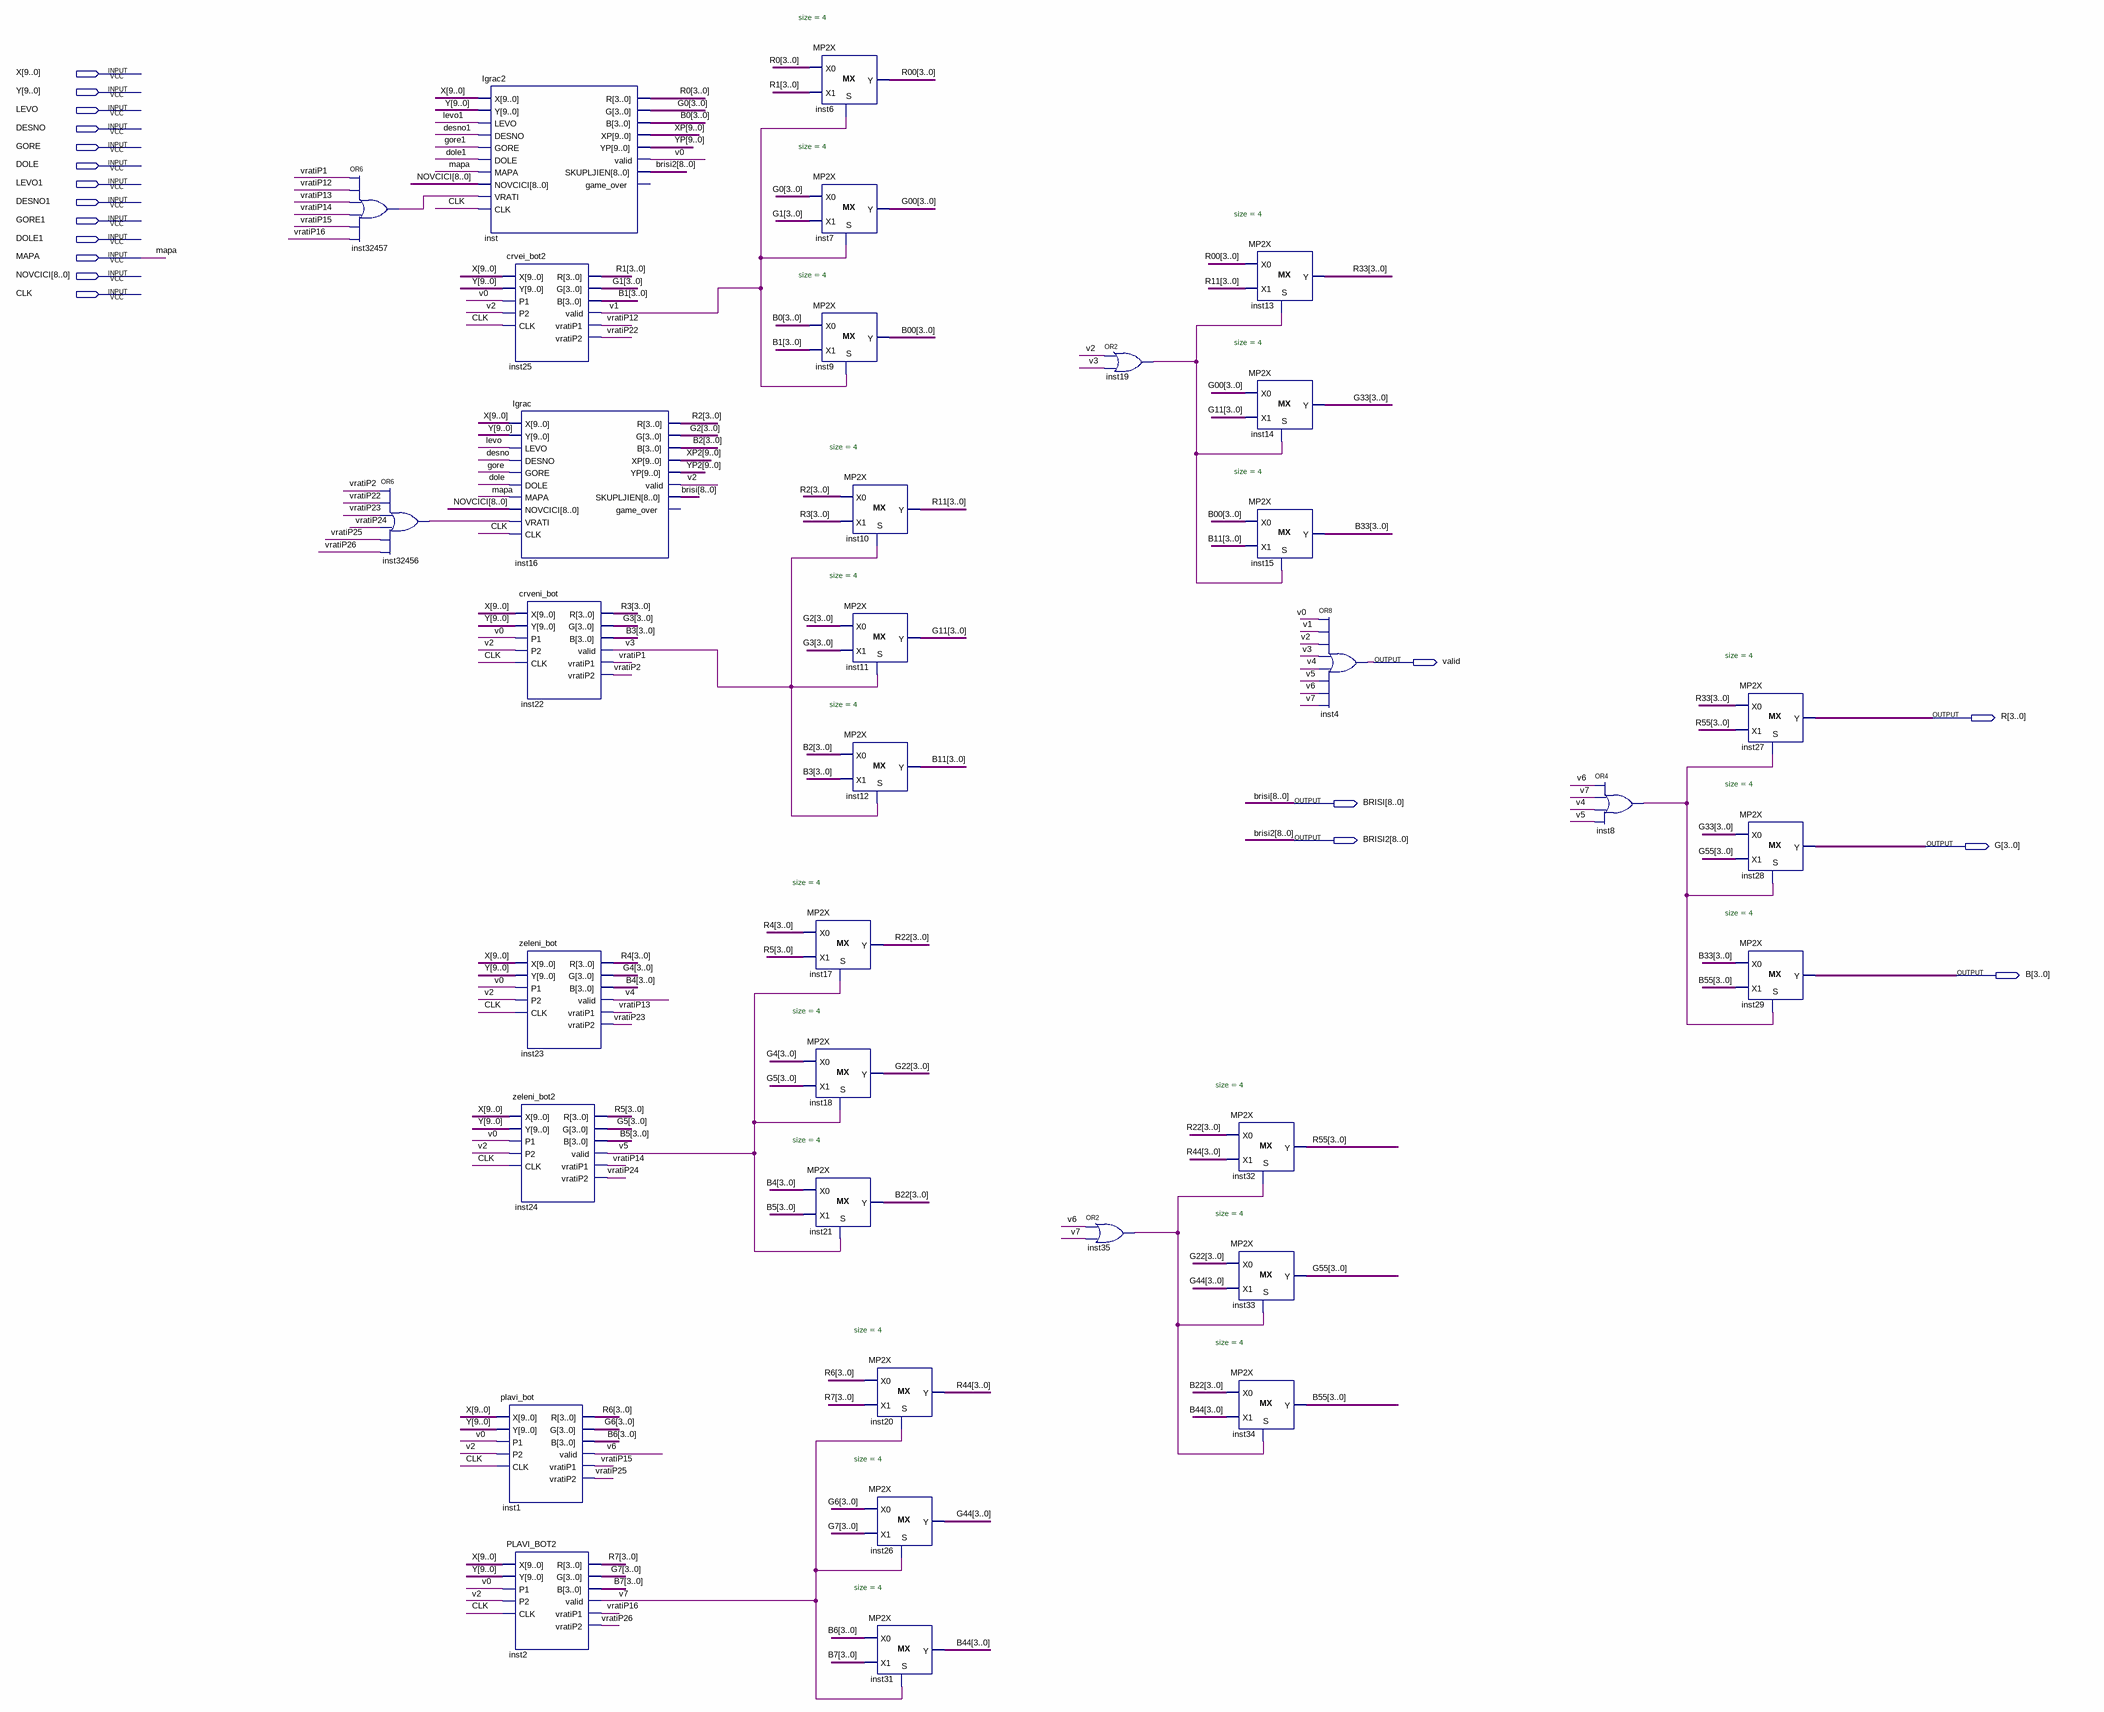
[diagram p0: schematic sheet]
// Quartus schematic igraci.bdf as structural Verilog: 35 symbols, 19 pins
module igraci (
  input  [9:0] X,
  input  [9:0] Y,
  input  LEVO,
  input  DESNO,
  input  GORE,
  input  DOLE,
  input  LEVO1,
  input  DESNO1,
  input  GORE1,
  input  DOLE1,
  input  MAPA,
  input  [8:0] NOVCICI,
  input  CLK,
  output valid,
  output [3:0] R,
  output [8:0] BRISI,
  output [8:0] BRISI2,
  output [3:0] G,
  output [3:0] B
);

  wire inst8_out, inst19_out, inst35_out, inst32456_out, inst32457_out, v0, v1, v2, v3, v4, v5, v6, v7,
       vratiP1, vratiP2, vratiP12, vratiP13, vratiP14, vratiP15, vratiP16, vratiP22, vratiP23, vratiP24,
       vratiP25, vratiP26;
  wire [3:0] B00, B0, B1, B2, B3, B4, B5, B6, B7, B11, B22, B33, B44, B55, G00, G0, G1, G2, G3, G4, G5, G6,
       G7, G11, G22, G33, G44, G55, R0, R00, R1, R2, R3, R4, R5, R6, R7, R11, R22, R33, R44, R55;
  wire [9:0] XP, XP2, YP, YP2;

  or inst32457 (inst32457_out, vratiP1, vratiP12, vratiP13, vratiP14, vratiP15, vratiP16);
  or inst32456 (inst32456_out, vratiP2, vratiP22, vratiP23, vratiP24, vratiP25, vratiP26);
  Igrac2 inst (
    .X(X), .Y(Y), .LEVO(LEVO1), .DESNO(DESNO1), .GORE(GORE1), .DOLE(DOLE1), .MAPA(MAPA), .NOVCICI(NOVCICI),
    .VRATI(inst32457_out), .CLK(CLK), .R(R0), .G(G0), .B(B0), .XP(XP), .YP(YP), .valid(v0), .SKUPLJIEN(BRISI2));  // open: game_over
  crvei_bot2 inst25 (
    .X(X), .Y(Y), .P1(v0), .P2(v2), .CLK(CLK), .R(R1), .G(G1), .B(B1), .valid(v1), .vratiP1(vratiP12),
    .vratiP2(vratiP22));
  Igrac inst16 (
    .X(X), .Y(Y), .LEVO(LEVO), .DESNO(DESNO), .GORE(GORE), .DOLE(DOLE), .MAPA(MAPA), .NOVCICI(NOVCICI),
    .VRATI(inst32456_out), .CLK(CLK), .R(R2), .G(G2), .B(B2), .XP(XP2), .YP(YP2), .valid(v2),
    .SKUPLJIEN(BRISI));  // open: game_over
  zeleni_bot2 inst24 (
    .X(X), .Y(Y), .P1(v0), .P2(v2), .CLK(CLK), .R(R5), .G(G5), .B(B5), .valid(v5), .vratiP1(vratiP14),
    .vratiP2(vratiP24));
  plavi_bot inst1 (
    .X(X), .Y(Y), .P1(v0), .P2(v2), .CLK(CLK), .R(R6), .G(G6), .B(B6), .valid(v6), .vratiP1(vratiP15),
    .vratiP2(vratiP25));
  PLAVI_BOT2 inst2 (
    .X(X), .Y(Y), .P1(v0), .P2(v2), .CLK(CLK), .R(R7), .G(G7), .B(B7), .valid(v7), .vratiP1(vratiP16),
    .vratiP2(vratiP26));
  crveni_bot inst22 (
    .X(X), .Y(Y), .P1(v0), .P2(v2), .CLK(CLK), .R(R3), .G(G3), .B(B3), .valid(v3), .vratiP1(vratiP1),
    .vratiP2(vratiP2));
  zeleni_bot inst23 (
    .X(X), .Y(Y), .P1(v0), .P2(v2), .CLK(CLK), .R(R4), .G(G4), .B(B4), .valid(v4), .vratiP1(vratiP13),
    .vratiP2(vratiP23));
  MP2X #(.size(4)) inst17 (.S(v5), .X0(R4), .X1(R5), .Y(R22));
  MP2X #(.size(4)) inst18 (.S(v5), .X0(G4), .X1(G5), .Y(G22));
  MP2X #(.size(4)) inst21 (.S(v5), .X0(B4), .X1(B5), .Y(B22));
  MP2X #(.size(4)) inst6 (.S(v1), .X0(R0), .X1(R1), .Y(R00));
  MP2X #(.size(4)) inst7 (.S(v1), .X0(G0), .X1(G1), .Y(G00));
  MP2X #(.size(4)) inst9 (.S(v1), .X0(B0), .X1(B1), .Y(B00));
  MP2X #(.size(4)) inst10 (.S(v3), .X0(R2), .X1(R3), .Y(R11));
  MP2X #(.size(4)) inst11 (.S(v3), .X0(G2), .X1(G3), .Y(G11));
  MP2X #(.size(4)) inst12 (.S(v3), .X0(B2), .X1(B3), .Y(B11));
  MP2X #(.size(4)) inst20 (.S(v7), .X0(R6), .X1(R7), .Y(R44));
  MP2X #(.size(4)) inst26 (.S(v7), .X0(G6), .X1(G7), .Y(G44));
  MP2X #(.size(4)) inst31 (.S(v7), .X0(B6), .X1(B7), .Y(B44));
  or inst35 (inst35_out, v6, v7);
  or inst19 (inst19_out, v2, v3);
  MP2X #(.size(4)) inst13 (.S(inst19_out), .X0(R00), .X1(R11), .Y(R33));
  MP2X #(.size(4)) inst14 (.S(inst19_out), .X0(G00), .X1(G11), .Y(G33));
  MP2X #(.size(4)) inst15 (.S(inst19_out), .X0(B00), .X1(B11), .Y(B33));
  MP2X #(.size(4)) inst32 (.S(inst35_out), .X0(R22), .X1(R44), .Y(R55));
  MP2X #(.size(4)) inst33 (.S(inst35_out), .X0(G22), .X1(G44), .Y(G55));
  MP2X #(.size(4)) inst34 (.S(inst35_out), .X0(B22), .X1(B44), .Y(B55));
  or inst4 (valid, v0, v1, v2, v3, v4, v5, v6, v7);
  or inst8 (inst8_out, v6, v7, v4, v5);
  MP2X #(.size(4)) inst27 (.S(inst8_out), .X0(R33), .X1(R55), .Y(R));
  MP2X #(.size(4)) inst28 (.S(inst8_out), .X0(G33), .X1(G55), .Y(G));
  MP2X #(.size(4)) inst29 (.S(inst8_out), .X0(B33), .X1(B55), .Y(B));
endmodule
